# Altium schematic sheet charger.SchDoc
size A4; SheetNumber: 4; SheetTotal: 4
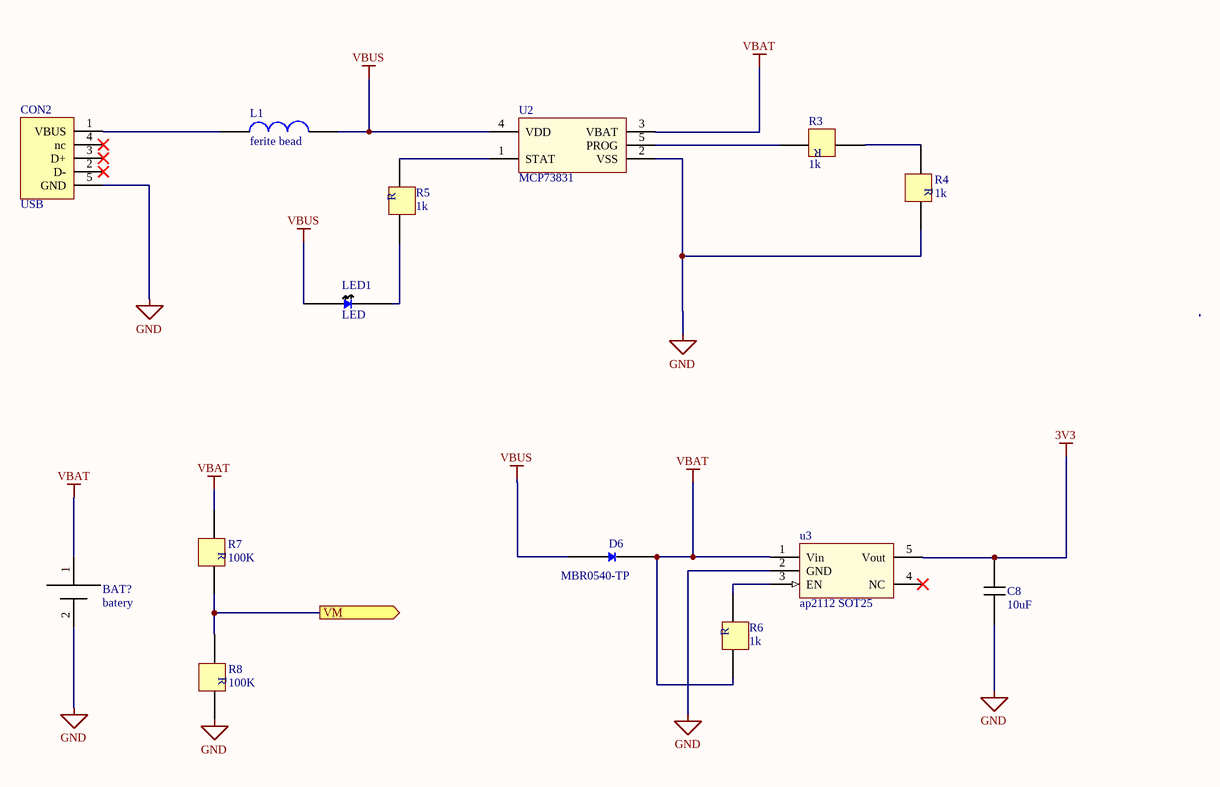
[diagram p0: charger.SchDoc]

## Parts
BAT?  batery  [jst 2pin]
C8  10uF  [0603]
CON2  USB  [microusb]
D6  MBR0540-TP  [Diode]
L1  ferite bead  [0603]
LED1  LED  [LED]
R3  1k  [0603]
R4  1k  [0603]
R5  1k  [0603]
R6  1k  [0603]
R7  100K  [0603]
R8  100K  [0603]
U2  MCP73831  [MCP73831/2]
u3  ap2112 SOT25  [AP2112 sot25]

## Ports
VM (out)

## Nets
3V3: C8.1 u3.5(Vout)
GND: BAT?.2 C8.2 CON2.5(GND) R4.1 R8.1 U2.2(VSS) u3.2(GND)
VBAT: BAT?.1 D6.2 R6.2 R7.2 U2.3(VBAT) u3.1(Vin)
VBUS: D6.1 L1.1 LED1.1 U2.4(VDD)
VM: R7.1 R8.2 ; port VM
NetCON2_1: CON2.1(VBUS) L1.2
NetLED1_2: LED1.2 R5.2
NetR3_1: R3.1 U2.5(PROG)
NetR3_2: R3.2 R4.2
NetR5_1: R5.1 U2.1(STAT)
NetR6_1: R6.1 u3.3(EN)

Not connected (* = marked no-connect by the designer): CON2 2(D-)* 3(D+)* 4(nc)*; u3 4(NC)*

## Notes on the sheet
- (in symbol resistor) R

## Library data of the parts
C8 = capacitor
D6 = diode
L1 = Spoel
R3-R8 = resistor